# Altium schematic sheet Digital Inputs.SchDoc: Title
size A4; Project: Q24 VCU; ENG_APP_DATE: --/--/--; DSN_APP_DATE: --/--/--; CHK_APP_DATE: --/--/--; Date: *******; ApprovedBy: *******; CheckedBy: None; Author: *******; CompanyName: *******; DrawnBy: Jacob Chisholm; Engineer: *******; Organization: *******; Address1: *******; Address2: *******; Address3: *******; Address4: *******; DocumentNumber: 13; Revision: *******; SheetNumber: 13; SheetTotal: 14; Address_Website: https://jchisholm204.github.io; E-Mail: JacobChisholm1010@gmail.com; CurrentTime: *******; CurrentDate: *******; Time: *******; DocumentFullPathAndName: *******; DocumentName: *******; ModifiedDate: *******; ImagePath: *******; ProjectName: *******; Application_BuildNumber: *******
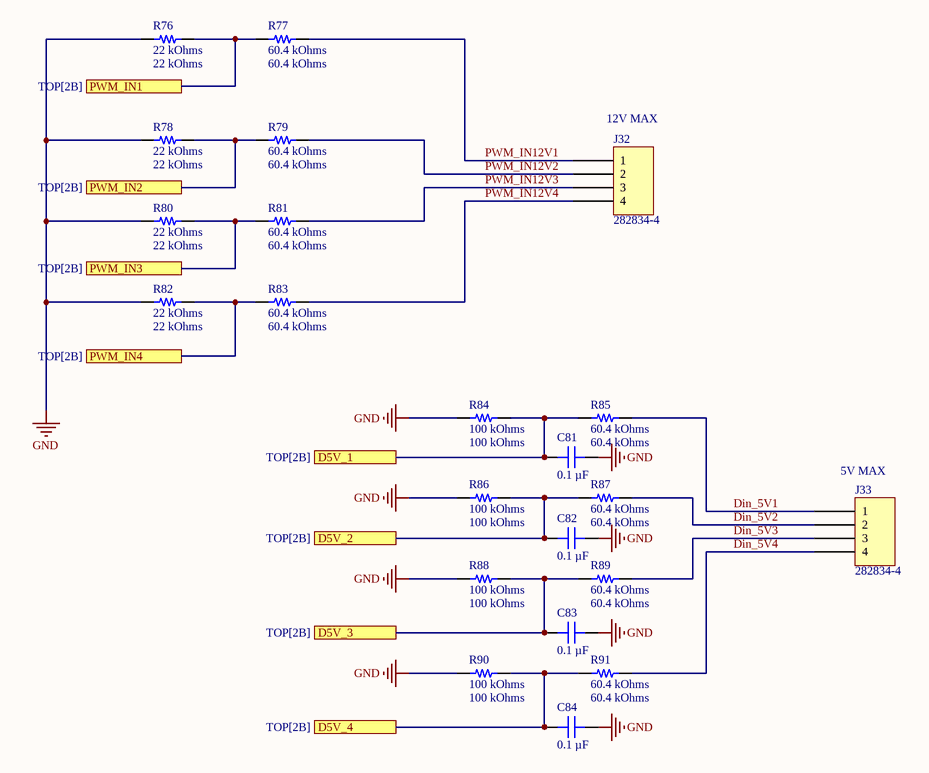
[diagram p0: Digital Inputs.SchDoc]

## Parts
C81  0.1 µF  [CAP 0603_1608]
C82  0.1 µF  [CAP 0603_1608]
C83  0.1 µF  [CAP 0603_1608]
C84  0.1 µF  [CAP 0603_1608]
J32  282834-4  [TE 282834-4]
J33  282834-4  [TE 282834-4]
R76  22 kOhms  [RES 0603_1608]
R77  60.4 kOhms  [RES 0603_1608]
R78  22 kOhms  [RES 0603_1608]
R79  60.4 kOhms  [RES 0603_1608]
R80  22 kOhms  [RES 0603_1608]
R81  60.4 kOhms  [RES 0603_1608]
R82  22 kOhms  [RES 0603_1608]
R83  60.4 kOhms  [RES 0603_1608]
R84  100 kOhms  [RES 0603_1608]
R85  60.4 kOhms  [RES 0603_1608]
R86  100 kOhms  [RES 0603_1608]
R87  60.4 kOhms  [RES 0603_1608]
R88  100 kOhms  [RES 0603_1608]
R89  60.4 kOhms  [RES 0603_1608]
R90  100 kOhms  [RES 0603_1608]
R91  60.4 kOhms  [RES 0603_1608]

## Ports
D5V_1 (see TOP[2B]), D5V_2 (see TOP[2B]), D5V_3 (see TOP[2B]), D5V_4 (see TOP[2B]), PWM_IN1 (see TOP[2B]), PWM_IN2 (see TOP[2B]), PWM_IN3 (see TOP[2B]), PWM_IN4 (see TOP[2B])

## Nets
GND: C81.2 C82.2 C83.2 C84.2 R76.2 R78.2 R80.2 R82.2 R84.1 R86.1 R88.1 R90.1
D5V_1: C81.1 R84.2 R85.1 ; port D5V_1
D5V_2: C82.1 R86.2 R87.1 ; port D5V_2
D5V_3: C83.1 R88.2 R89.1 ; port D5V_3
D5V_4: C84.1 R90.2 R91.1 ; port D5V_4
Din_5V1: J33.1 R85.2
Din_5V2: J33.2 R87.2
Din_5V3: J33.3 R89.2
Din_5V4: J33.4 R91.2
PWM_IN1: R76.1 R77.2 ; port PWM_IN1
PWM_IN2: R78.1 R79.2 ; port PWM_IN2
PWM_IN3: R80.1 R81.2 ; port PWM_IN3
PWM_IN4: R82.1 R83.2 ; port PWM_IN4
PWM_IN12V1: J32.1 R77.1
PWM_IN12V2: J32.2 R79.1
PWM_IN12V3: J32.3 R81.1
PWM_IN12V4: J32.4 R83.1

## Notes on the sheet
- (near J32) 12V MAX
- (near J33) 5V MAX
- Title:
- Drawn By:
- Page Contents:
- Checked By:
- Size:
- Date:
- File:
- License:
- Email:
- A4
- Number:
- Time:
- Revision:
- Sheet
- Website:
- of

## Library data of the parts
C81-C84 = 6R3X14W104MV4T: CAP CER 0.1UF 6.3V X7R 0603; manufacturer: Johanson Dielectrics Inc.; Tolerance: ±20%; Part Number: 6R3X14W104MV4T; Value: 0.1 µF; Applications: Bypass, Decoupling; Capacitance: 0.1 µF; componentlink1description: Datasheet; componentlink1url: https://www.johansondielectrics.com/downloads/x2y-filter-and-decoupling-capacitors.pdf; componentlink2description: DigiKey Link; componentlink2url: https://www.digikey.com/en/products/detail/johanson-dielectrics-inc/6R3X14W104MV4T/1556331; Device Package: 0603 (1608 Metric); Features: Low ESL (X2Y); lastupdated: 1/24/2024 8:09:44 PM; Lifecycle Status: Active; Minimum Order: 1; Mounting Type: Surface Mount, MLCC; Operating Temperature: -55°C ~ 125°C; Package / Case: 0603 (1608 Metric); packaging: TapeAndReel; partid: 2650; Part Status: Active; price: 0.08; series: X2Y®; Size / Dimension: 0.064" L x 0.035" W (1.63mm x 0.89mm); Supplier 1: DigiKey; Supplier Part Number 1: 709-1009-1-ND; Temperature Coefficient: X7R; Thickness (Max): 0.026" (0.66mm); Voltage - Rated: 6.3V
J32 J33 = 282834-4: TERM BLK 4P SIDE ENT 2.54MM PCB; Manufacturer: TE Connectivity AMP Connectors; Current: 10A; Mating Orientation: Horizontal with Board; Number of Levels: 1; Pitch: 0.100" (2.54mm); Positions Per Level: 4; Voltage: 150V; Wire Gauge: 16-30 AWG; Wire Termination: Screw - Rising Cage Clamp; Part Number: 282834-4; Color: Green; ComponentLink1Description: Datasheet; ComponentLink1URL: https://www.te.com/commerce/DocumentDelivery/DDEController?Action=srchrtrv&DocNm=282834&DocType=Customer+Drawing&DocLang=English; ComponentLink2Description: DigiKey Link; ComponentLink2URL: http://digikey.com/product-detail/en/te-connectivity-amp-connectors/282834-4/A98335-ND/1153265; LastUpdated: 1/15/2020 4:16:05 AM; Lifecycle Status: Active; Minimum Order: 1; Mounting Type: Through Hole; Packaging: Bulk; Part Status: Active; Price: 2.68; Series: Buchanan; Supplier 1: DigiKey; Supplier Part Number 1: A98335-ND
R76 R78 R80 R82 = AC0603FR-7W22KL: RES 22K OHM 1% 1/5W 0603; Part Number: AC0603FR-7W22KL; Value: 22 kOhms
R77 R79 R81 R83 R85 R87 R89 R91 = AC0603FR-0760K4L: RES SMD 60.4K OHM 1% 1/10W 0603; Part Number: AC0603FR-0760K4L; Value: 60.4 kOhms
R84 R86 R88 R90 = AA0603FR-07100KL: RES SMD 100K OHM 1% 1/10W 0603; Part Number: AA0603FR-07100KL; Value: 100 kOhms